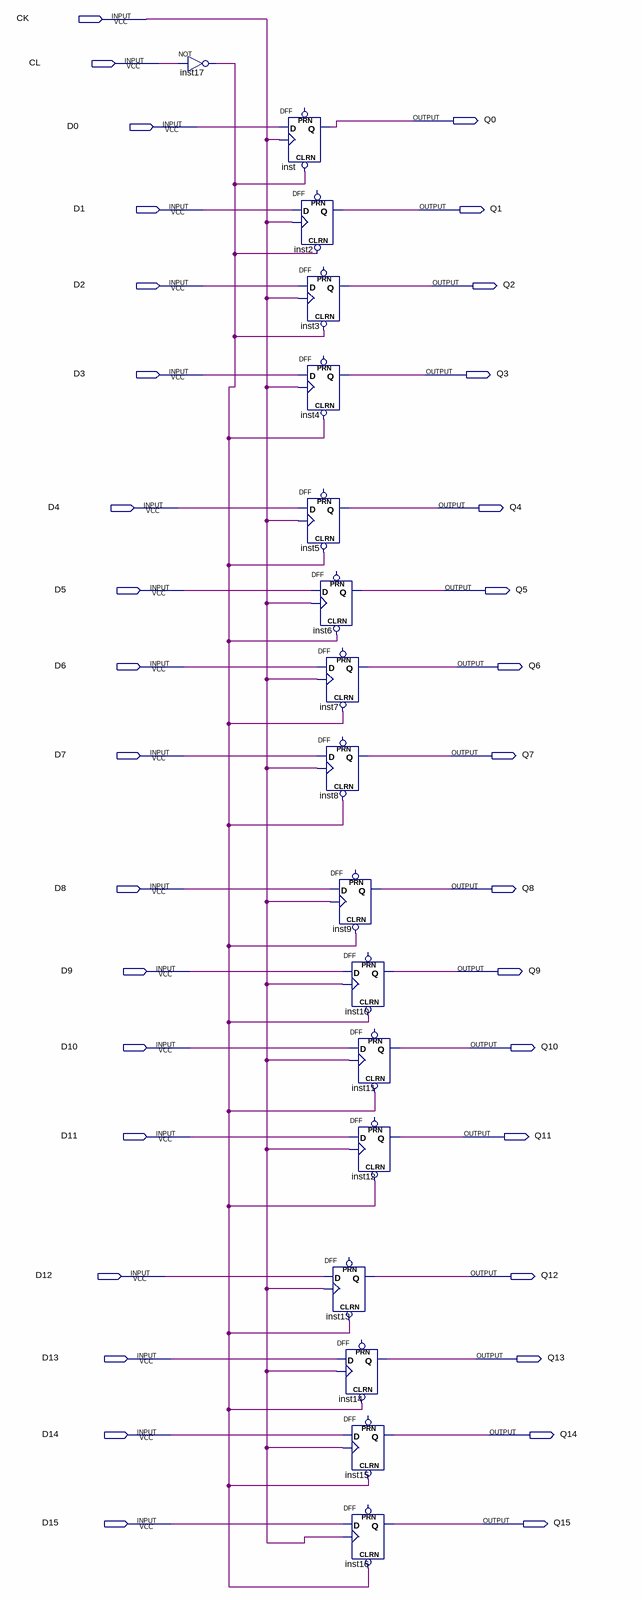
[diagram p0: schematic sheet]
// Quartus schematic register_16bit.bdf as structural Verilog: 17 symbols, 34 pins
module register_16bit (
  input  CK,
  input  CL,
  input  D0,
  input  D1,
  input  D2,
  input  D3,
  input  D4,
  input  D5,
  input  D6,
  input  D7,
  input  D8,
  input  D9,
  input  D10,
  input  D11,
  input  D12,
  input  D13,
  input  D14,
  input  D15,
  output Q0,
  output Q1,
  output Q2,
  output Q3,
  output Q4,
  output Q5,
  output Q6,
  output Q7,
  output Q8,
  output Q9,
  output Q10,
  output Q11,
  output Q12,
  output Q13,
  output Q14,
  output Q15
);

  wire inst17_out;

  not inst17 (inst17_out, CL);
  DFF inst (.CLRN(inst17_out), .CLK(CK), .D(D0), .Q(Q0));  // open: PRN
  DFF inst2 (.CLRN(inst17_out), .CLK(CK), .D(D1), .Q(Q1));  // open: PRN
  DFF inst3 (.CLRN(inst17_out), .CLK(CK), .D(D2), .Q(Q2));  // open: PRN
  DFF inst4 (.CLRN(inst17_out), .CLK(CK), .D(D3), .Q(Q3));  // open: PRN
  DFF inst5 (.CLRN(inst17_out), .CLK(CK), .D(D4), .Q(Q4));  // open: PRN
  DFF inst6 (.CLRN(inst17_out), .CLK(CK), .D(D5), .Q(Q5));  // open: PRN
  DFF inst7 (.CLRN(inst17_out), .CLK(CK), .D(D6), .Q(Q6));  // open: PRN
  DFF inst8 (.CLRN(inst17_out), .CLK(CK), .D(D7), .Q(Q7));  // open: PRN
  DFF inst9 (.CLRN(inst17_out), .CLK(CK), .D(D8), .Q(Q8));  // open: PRN
  DFF inst10 (.CLRN(inst17_out), .CLK(CK), .D(D9), .Q(Q9));  // open: PRN
  DFF inst13 (.CLRN(inst17_out), .CLK(CK), .D(D12), .Q(Q12));  // open: PRN
  DFF inst14 (.CLRN(inst17_out), .CLK(CK), .D(D13), .Q(Q13));  // open: PRN
  DFF inst15 (.CLRN(inst17_out), .CLK(CK), .D(D14), .Q(Q14));  // open: PRN
  DFF inst16 (.CLRN(inst17_out), .CLK(CK), .D(D15), .Q(Q15));  // open: PRN
  DFF inst11 (.CLRN(inst17_out), .CLK(CK), .D(D10), .Q(Q10));  // open: PRN
  DFF inst12 (.CLRN(inst17_out), .CLK(CK), .D(D11), .Q(Q11));  // open: PRN
endmodule
